# EAGLE design FuckIO_REV01 (EAGLE 9.6.1)
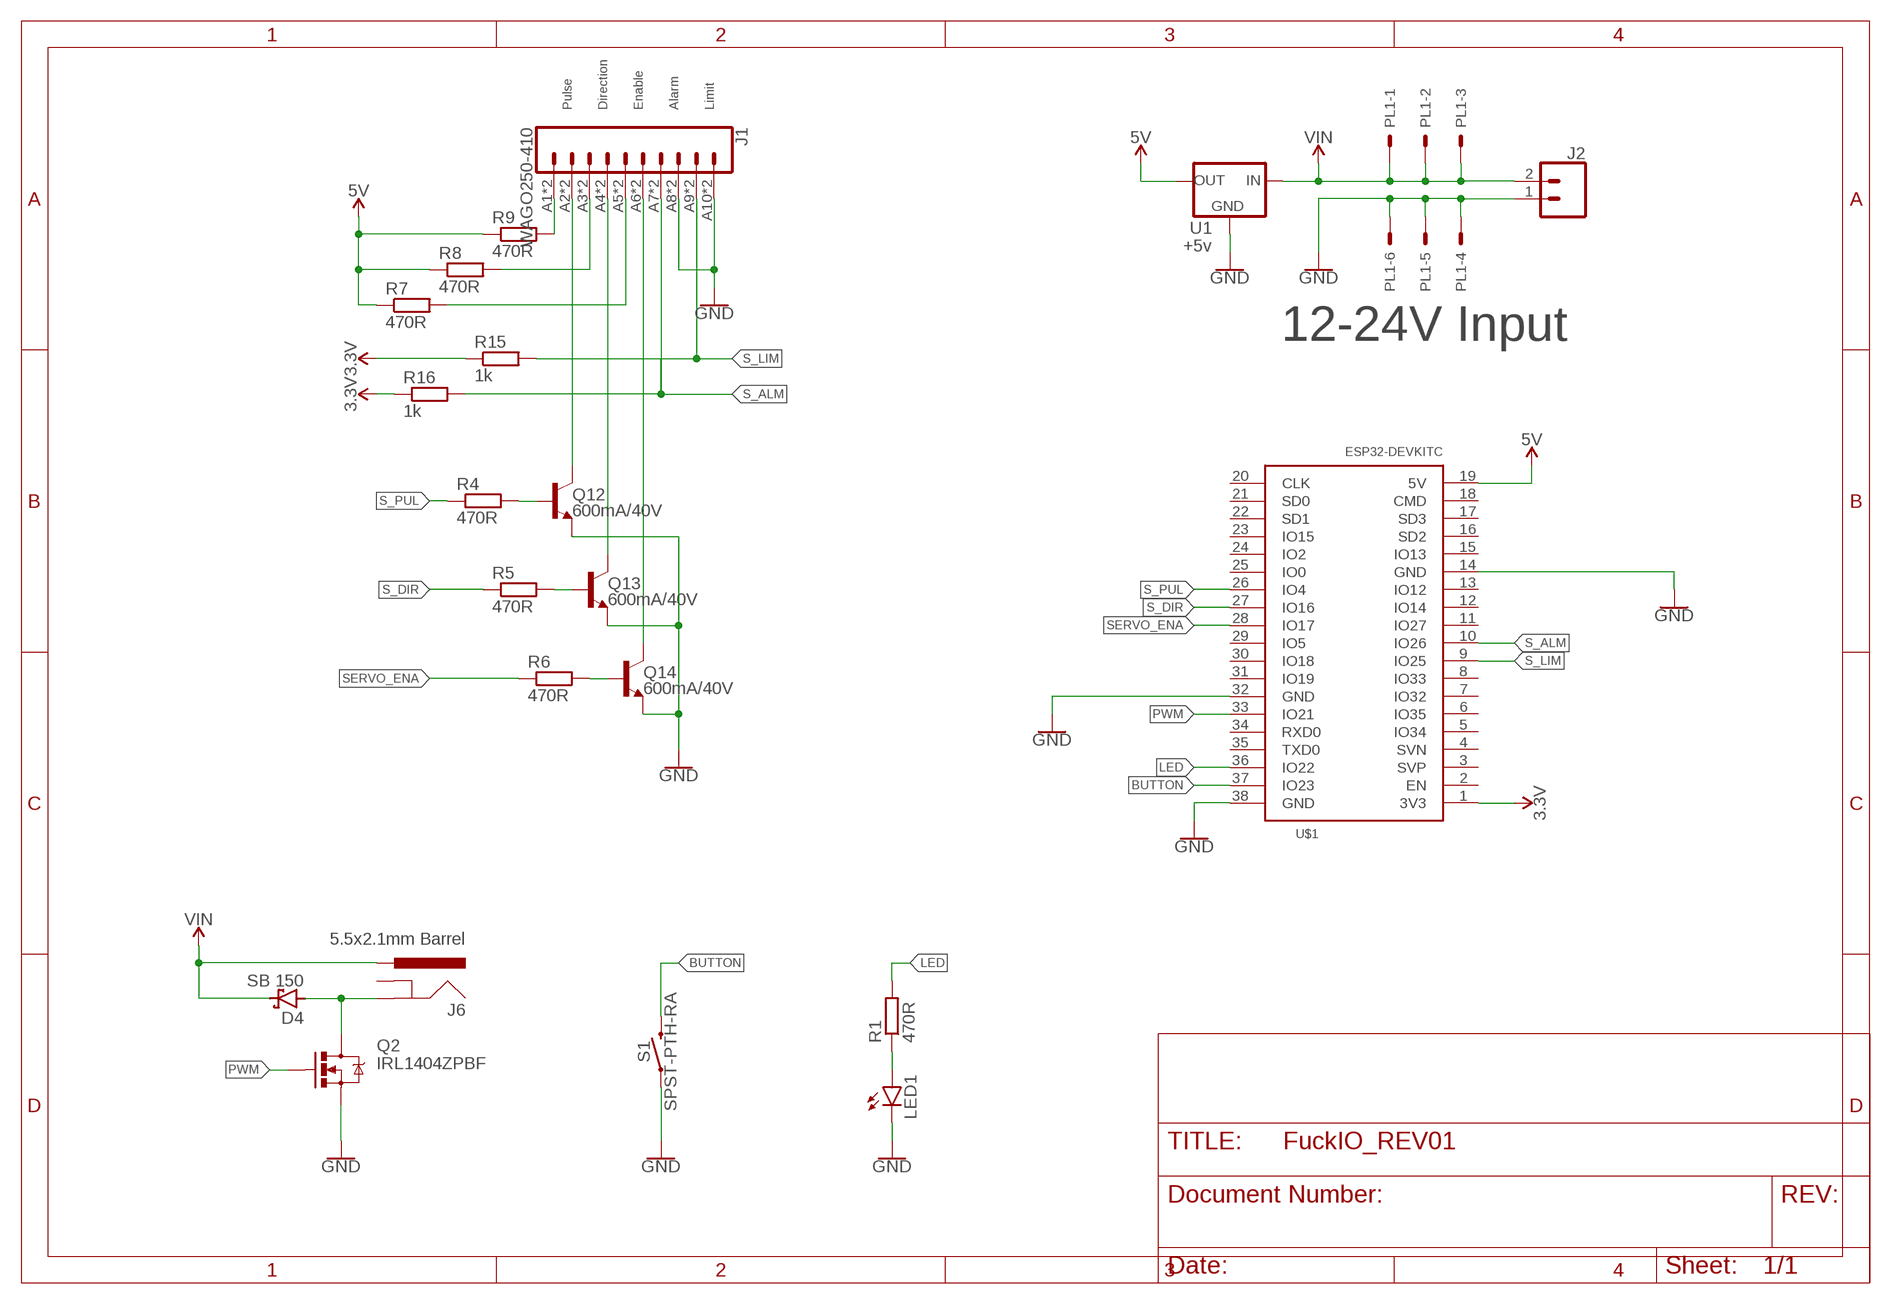
[diagram p0: schematic, sheet 1]

## Parts
D4  SB 150  BAT49  [DIODE_DO41-10]
J1  WAGO250-410  [BEE_WAGO250-410]
J2  CONN_025MM  [SPARKFUN-CONNECTORS_SCREWTERMINAL-5MM-2]
J6  5.5x2.1mm Barrel  POWER_JACK  [SPARKFUN-CONNECTORS_POWER_JACK_PTH]
LED1  LED5MM  [LED5MM]
PL1  CON-MOLEX-2_555X-6H  [CON-MOLEX-2_5569-6]
Q2  IRL1404ZPBF  MOSFET-NCHANNELTO220  [BEE_TO220-IGO]
Q12  600mA/40V  TRANS_NPN-P2N2222A  [SPARKFUN-DISCRETESEMI_TO-92]
Q13  600mA/40V  TRANS_NPN-P2N2222A  [SPARKFUN-DISCRETESEMI_TO-92]
Q14  600mA/40V  TRANS_NPN-P2N2222A  [SPARKFUN-DISCRETESEMI_TO-92]
R1  470R  RCL_R-EU_0204/5  [RCL_0204/5]
R4  470R  RCL_R-EU_0204/5  [RCL_0204/5]
R5  470R  RCL_R-EU_0204/5  [RCL_0204/5]
R6  470R  RCL_R-EU_0204/5  [RCL_0204/5]
R7  470R  RCL_R-EU_0204/5  [RCL_0204/5]
R8  470R  RCL_R-EU_0204/5  [RCL_0204/5]
R9  470R  RCL_R-EU_0204/5  [RCL_0204/5]
R15  1k  RCL_R-EU_0204/5  [RCL_0204/5]
R16  1k  RCL_R-EU_0204/5  [RCL_0204/5]
S1  SPST-PTH-RA  MOMENTARY-SWITCH-SPST-PTH-RIGHT-ANGLE-KIT  [TACTILE_SWITCH_PTH_RIGHT_ANGLE_KIT]
U1  +5v  V_REG_78XXSINK  [SPARKFUN-IC-POWER_TO220-IGO]
U$1  ESP32DEVKITC  [ESP32-DEVKITC]

## Nets
3.3V: R15.1 R16.1 U$1.1(3V3)
5V: R7.1 R8.1 R9.1 U1.OUT U$1.19(5V)
BUTTON: S1.2 U$1.37(IO23)
GND: J1.A8 J1.A10 J1.B8 J1.B10 J2.1 LED1.K(C) PL1.4 PL1.5 PL1.6 Q2.S Q12.3(E) Q13.3(E) Q14.3(E) S1.1 U1.GND U$1.14(GND) U$1.32(GND) U$1.38(GND)
LED: R1.2 U$1.36(IO22)
N$1: LED1.A R1.1
N$2: J1.A5 J1.B5 R7.2
N$9: J1.A3 J1.B3 R8.2
N$10: J1.A1 J1.B1 R9.2
N$11: J1.A6 J1.B6 Q14.1(C)
N$12: J1.A4 J1.B4 Q13.1(C)
N$13: J1.A2 J1.B2 Q12.1(C)
N$18: Q12.2(B) R4.2
N$19: Q13.2(B) R5.2
N$20: Q14.2(B) R6.2
N$30: D4.A J6.GND Q2.D
PWM: Q2.G U$1.33(IO21)
S_ALM: J1.A7 J1.B7 R16.2 U$1.10(IO26)
S_DIR: R5.1 U$1.27(IO16)
S_LIM: J1.A9 J1.B9 R15.2 U$1.9(IO25)
S_PUL: R4.1 U$1.26(IO4)
SERVO_ENA: R6.1 U$1.28(IO17)
VIN: D4.C J2.2 J6.PWR PL1.1 PL1.2 PL1.3 U1.IN
Unconnected: J6.GNDBREAK U$1.2(EN) U$1.3(SVP) U$1.4(SVN) U$1.5(IO34) U$1.6(IO35) U$1.7(IO32) U$1.8(IO33) U$1.11(IO27) U$1.12(IO14) U$1.13(IO12) U$1.15(IO13) U$1.16(SD2) U$1.17(SD3) U$1.18(CMD) U$1.20(CLK) U$1.21(SD0) U$1.22(SD1) U$1.23(IO15) U$1.24(IO2) U$1.25(IO0) U$1.29(IO5) U$1.30(IO18) U$1.31(IO19) U$1.34(RXD0) U$1.35(TXD0)

## Notes on the sheet
- Pulse | Direction | Enable | Alarm | Limit
- 12-24V Input

## Library data of the parts
D4 = FuckIO_REV00:BAT49: DIODE small signal diode
J1 = FuckIO_REV00:WAGO250-410
J2 = FuckIO_REV00:CONN_02: Multi connection point. Often used as Generic Header-pin footprint for 0.1 inch spaced/style header connections On any of the 0.1 inch spaced packages, you can populate with these: Break Away Headers - Straight <https://www.sparkfun.com/products/116> (PRT-00116) Break Away Male Headers - Right Angle <https://www.sparkfun.com/products/553> (PRT-00553) Female Headers <https://www.sparkfun.com/products/115> (PRT-00115) Break Away Headers - Machine Pin <https://www.sparkfun.com/products/117> (PRT-00117) Break Away Female Headers - Swiss Machine Pin <https://www.sparkfun.com/products/743> (PRT-00743) For SCREWTERMINALS and SPRING TERMINALS visit here: Screw Terimnals on SparkFun.com <https://www.sparkfun.com/search/results?term=Screw+Terminals> (5mm/3.5mm/2.54mm spacing) This device is also useful as a general connection point to wire up your design to another part of your project. Our various solder wires solder well into these plated through hole pads. Hook-Up Wire - Assortment (Stranded, 22 AWG) <https://www.sparkfun.com/products/11375> (PRT-11375) Hook-Up Wire - Assortment (Solid Core, 22 AWG) <https://www.sparkfun.com/products/11367> (PRT-11367) View the entire wire category on our website here <https://www.sparkfun.com/categories/141> Special notes: Molex polarized connector foot print use with: PRT-08233 with associated crimp pins and housings. 2.54_SCREWTERM for use with PRT-10571. 3.5mm Screw Terminal footprints for PRT-08084 5mm Screw Terminal footprints for use with PRT-08432; PROD_ID: CONN-13512; SF_ID: PRT-09918; SF_SKU: PRT-08432; SKU: PRT-09914
J6 = FuckIO_REV00:POWER_JACK: Power Jack Connector This is the standard 5.5mm barrel jack for power. The PTH is the most common, proven, reliable, footprint. The Slot footprint only works if the mill layer is transmitted to the PCB fab house so be warned. Here are the connectors we sell at SparkFun: DC Barrel Power Jack/Connector <https://www.sparkfun.com/products/119> (PRT-00119) DC Barrel Power Jack/Connector (SMD) <https://www.sparkfun.com/products/12748> (PRT-12748) DC Barrel Jack Adapter - Breadboard Compatible <https://www.sparkfun.com/products/10811> (PRT-10811) It is used on this SparkFun product (and many, many others): SparkFun RedBoard - Programmed with Arduino <https://www.sparkfun.com/products/12757> (DEV-12757) Also, if you need a mating power supply or connector, please check these out: Wall Adapter Power Supply - 9VDC 650mA <https://www.sparkfun.com/products/298> (TOL-00298) DC Barrel Jack Adapter - Male <https://www.sparkfun.com/products/10287> (PRT-10287); PROD_ID: CONN-08106; SF_ID: PRT-12748
LED1 = led:LED: LED OSRAM: - CHIPLED LG R971, LG N971, LY N971, LG Q971, LY Q971, LO R971, LY R971 LH N974, LH R974 LS Q976, LO Q976, LY Q976 LO Q996 - Hyper CHIPLED LW Q18S LB Q993, LB Q99A, LB R99A - SideLED LS A670, LO A670, LY A670, LG A670, LP A670 LB A673, LV A673, LT A673, LW A673 LH A674 LY A675 LS A676, LA A676, LO A676, LY A676, LW A676 LS A679, LY A679, LG A679 - Hyper Micro SIDELED® LS Y876, LA Y876, LO Y876, LY Y876 LT Y87S - SmartLED LW L88C, LW L88S LB L89C, LB L89S, LG L890 LS L89K, LO L89K, LY L89K LS L896, LA L896, LO L896, LY L896 - TOPLED LS T670, LO T670, LY T670, LG T670, LP T670 LSG T670, LSP T670, LSY T670, LOP T670, LYG T670 LG T671, LOG T671, LSG T671 LB T673, LV T673, LT T673, LW T673 LH T674 LS T676, LA T676, LO T676, LY T676, LB T676, LH T676, LSB T676, LW T676 LB T67C, LV T67C, LT T67C, LS T67K, LO T67K, LY T67K, LW E67C LS E67B, LA E67B, LO E67B, LY E67B, LB E67C, LV E67C, LT E67C LW T67C LS T679, LY T679, LG T679 LS T770, LO T770, LY T770, LG T770, LP T770 LB T773, LV T773, LT T773, LW T773 LH T774 LS E675, LA E675, LY E675, LS T675 LS T776, LA T776, LO T776, LY T776, LB T776 LHGB T686 LT T68C, LB T68C - Hyper Mini TOPLED® LB M676 - Mini TOPLED Santana® LG M470 LS M47K, LO M47K, LY M47K Source: http://www.osram.convergy.de LUXEON: - LUMILED® LXK2-PW12-R00, LXK2-PW12-S00, LXK2-PW14-U00, LXK2-PW14-V00 LXK2-PM12-R00, LXK2-PM12-S00, LXK2-PM14-U00 LXK2-PE12-Q00, LXK2-PE12-R00, LXK2-PE12-S00, LXK2-PE14-T00, LXK2-PE14-U00 LXK2-PB12-K00, LXK2-PB12-L00, LXK2-PB12-M00, LXK2-PB14-N00, LXK2-PB14-P00, LXK2-PB14-Q00 LXK2-PR12-L00, LXK2-PR12-M00, LXK2-PR14-Q00, LXK2-PR14-R00 LXK2-PD12-Q00, LXK2-PD12-R00, LXK2-PD12-S00 LXK2-PH12-R00, LXK2-PH12-S00 LXK2-PL12-P00, LXK2-PL12-Q00, LXK2-PL12-R00 Source: www.luxeon.com KINGBRIGHT: KA-3528ASYC Source: www.kingbright.com
PL1 = FuckIO_REV00:CON-MOLEX-2_555X-6: Mini FIT connector 6 way
Q2 = FuckIO_REV00:MOSFET-NCHANNEL
Q12-Q14 = FuckIO_REV00:TRANS_NPN: NPN transistor Current controlled devices typically used to amplify current or used as a switch. BC547 - COM-08928 <http://www.sparkfun.com/products/8928> (TO-92 45V 100mA) (1.Collector 2.Base 3.Emitter) 2N3904 - COM-00521 <http://www.sparkfun.com/products/521> (TO-92 40V 200mA) (1.Emitter 2.Base 3.Collector) P2N2222A - COM-12852 <http://www.sparkfun.com/products/12852> (TO-92 40V 600mA) (1.Collector 2.Base 3.Emitter); PROD_ID: TRANS-09536
R1 R4-R9 R15 R16 = FuckIO_REV00:RCL_R-EU_: RESISTOR, European symbol; SPICEPREFIX: R
S1 = SparkFun-Switches:MOMENTARY-SWITCH-SPST: Momentary Switch (Pushbutton) - SPST Normally-open (NO) SPST momentary switches (buttons, pushbuttons). Variants PTH-12MM - 12mm square, through-hole Momentary Pushbutton Switch - 12mm Square <https://www.sparkfun.com/products/9190> (COM-09190) PTH-6.0MM, PTH-6.0MM-KIT - 6.0mm square, through-hole Mini Pushbutton Switch <https://www.sparkfun.com/products/97> (COM-00097) KIT package intended for soldering kit's - only one side of pads' copper is exposed. PTH-RIGHT-ANGLE-KIT - Right-angle, through-hole Right Angle Tactile Button <https://www.sparkfun.com/products/10791> - Used on SparkFun BigTime Watch Kit <https://www.sparkfun.com/products/11734> SMD-12MM - 12mm square, surface-mount Tactile Button - SMD (12mm) <https://www.sparkfun.com/products/12993> (COM-12993) Used on SparkFun PicoBoard <https://www.sparkfun.com/products/11888> SMD-4.5MM - 4.5mm Square Trackball Switch Used on SparkFun Blackberry Trackballer Breakout <https://www.sparkfun.com/products/13169> SMD-4.6MMX2.8MM - 4.60mm x 2.80mm, surface mount Used on SparkFun SAMD21 Mini Breakout <https://www.sparkfun.com/products/13664> SMD-5.2MM, SMD-5.2-REDUNDANT - 5.2mm square, surface-mount Mini Pushbutton Switch - SMD <https://www.sparkfun.com/products/8720> (COM-08720) Used on Arduino Pro Mini <https://www.sparkfun.com/products/11114> REDUNDANT package connects both switch circuits together SMD-6.0X3.5MM - 6.0 x 3.5mm, surface mount Momentary Reset Switch SMD <https://www.sparkfun.com/products/8229> (COM-08229) SMD-6.2MM-TALL - 6.2mm square, surface mount Tactile Button - SMD (6mm) <https://www.sparkfun.com/products/12992> Used on SparkFun Digital Sandbox <https://www.sparkfun.com/products/12651> SMD-RIGHT-ANGLE - Right-angle, surface mount Used on SparkFun Block for Intel® Edison - Arduino <https://www.sparkfun.com/products/13036>; PROD_ID: CONN-10672; SF_SKU: COM-10791
U1 = FuckIO_REV00:V_REG_78XX: Voltage Regulator Standard 78xx regulator. IGO (Input Ground Output). Spark Fun Electronics SKU : COM-00107; PROD_ID: VREG-12370; SF_ID: COM-00107; VALUE: +12v
U$1 = ESP32-DEVKITC:ESP32DEVKITC

## Board
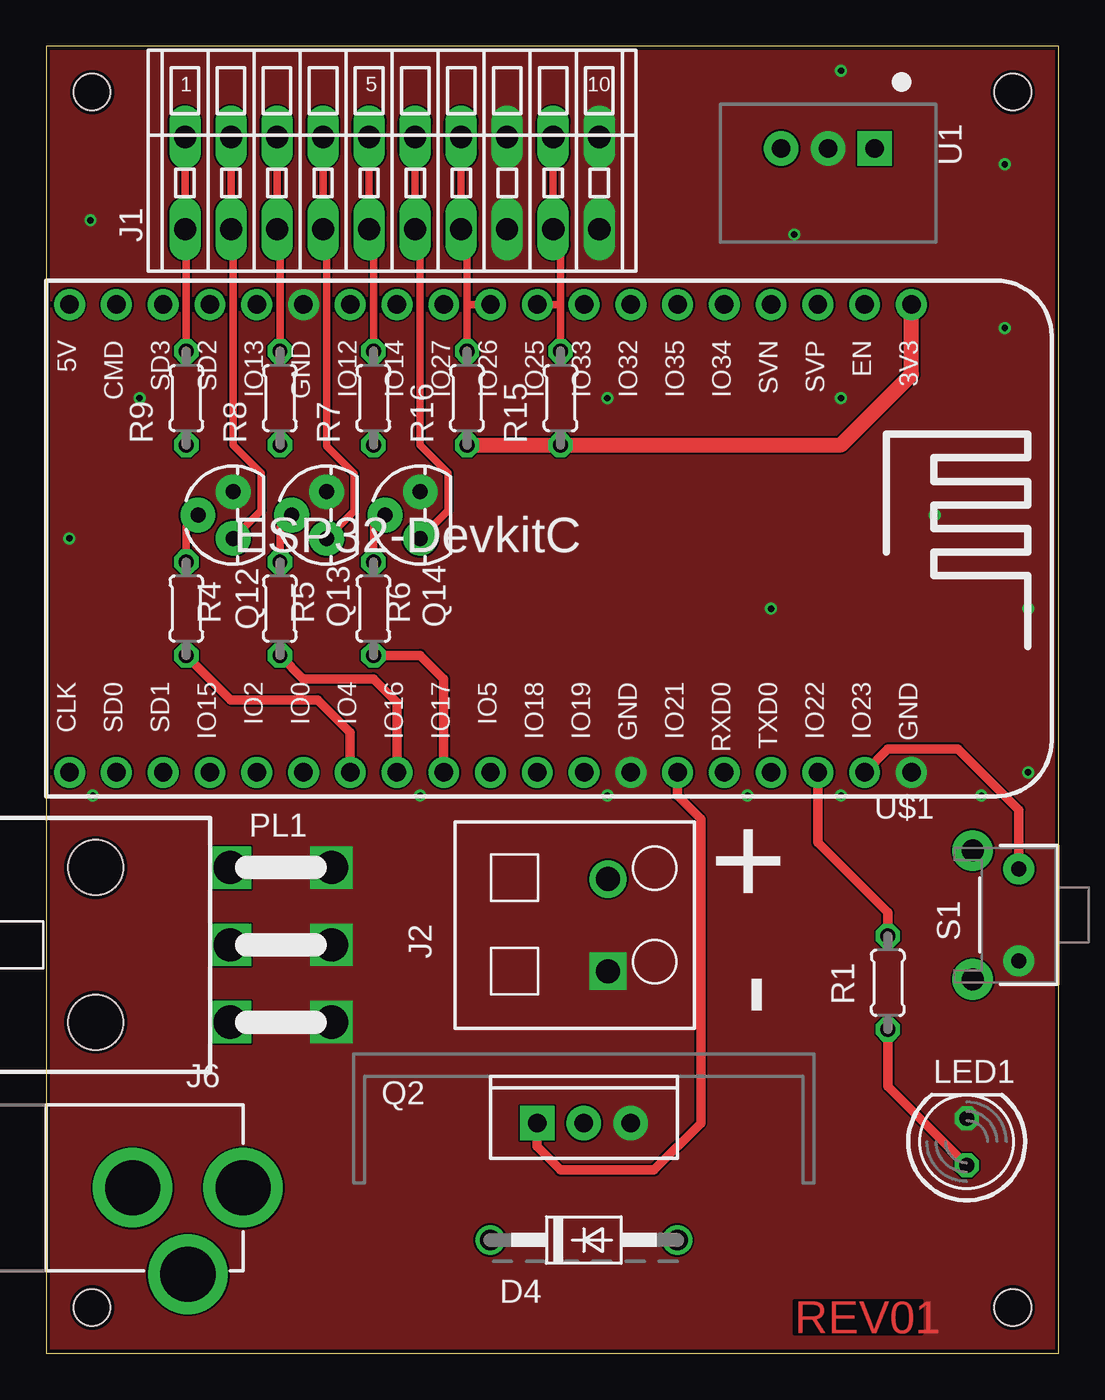
[diagram p1: board, top side]
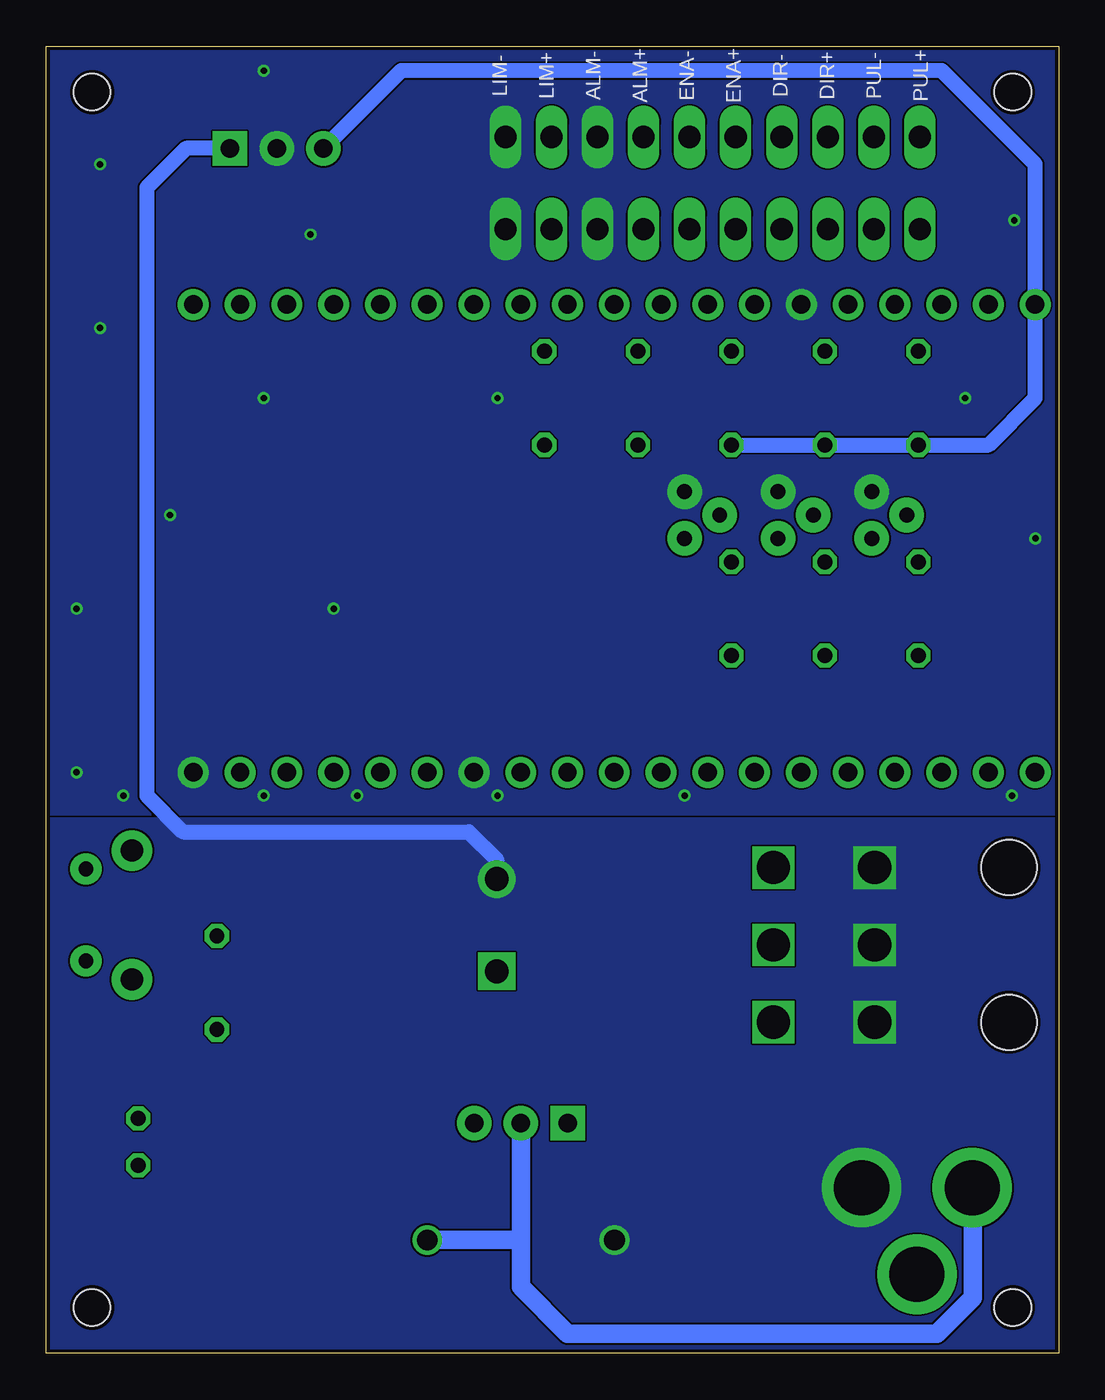
[diagram p2: board, bottom side, seen from below]

Size 55 x 71 mm. Coordinates in mm from the lower left corner, seen from the top.
Outline: 0,0 55,0 55,71 0,71 0,0
Copper layers (1*16): Top 0.035mm / dielectric 0.2mm / Bottom 0.035mm
Design rules "aisler_2_layer_blitz": minimum track width 0.1mm, minimum drill 0.2mm, track to track 0.1mm, track to pad 0.1mm, pad to pad 0.1mm, via to via 0.1mm, smd to smd 0.1mm, copper to edge 0.2mm, drill to drill 0.21mm, minimum pad ring 0.25mm, minimum via ring 0.15mm, stop-mask expansion 0mil, vias tented up to drill 0mil, thermal gap 10mil
Holes 2 mm at 2.5,68.5 52.5,68.5 2.5,2.5 52.5,2.5

### Footprints (pad centres in the part's own frame; a part is rotated, then mirrored left to right if it is on the bottom)
DIODE_DO41-10 = drill 1.118: A 5.08,0; C -5.08,0
BEE_WAGO250-410 = drill 1.2 long: A1 -11.25,2.5; A2 -8.75,2.5; A3 -6.25,2.5; A4 -3.75,2.5; A5 -1.25,2.5; A6 1.25,2.5; A7 3.75,2.5; A8 6.25,2.5; A9 8.75,2.5; A10 11.25,2.5; B1 -11.25,-2.5; B2 -8.75,-2.5; B3 -6.25,-2.5; B4 -3.75,-2.5; B5 -1.25,-2.5; B6 1.25,-2.5; B7 3.75,-2.5; B8 6.25,-2.5; B9 8.75,-2.5; B10 11.25,-2.5
SPARKFUN-CONNECTORS_SCREWTERMINAL-5MM-2 = drill 1.3 pad 2.032 square: 1 -2.54,0 | drill 1.3 pad 2.032: 2 2.46,0
SPARKFUN-CONNECTORS_POWER_JACK_PTH = drill 2.997 pad 4.318: GND 0,7.7; GNDBREAK 4.7,10.7; PWR 0,13.7
LED5MM = drill 0.813 octagon: A -1.27,0; K 1.27,0
CON-MOLEX-2_5569-6 = drill 1.8 square: 1 4.2,0; 2 0,0; 3 -4.2,0; 4 4.2,5.5; 5 0,5.5; 6 -4.2,5.5 | hole 3: 4.2,-7.3; -4.2,-7.3
BEE_TO220-IGO = drill 1 pad 1.88: D 0,0; S 2.54,0 | drill 1 pad 1.88 square: G -2.54,0
SPARKFUN-DISCRETESEMI_TO-92 = drill 0.813 pad 1.88: 1 -1.27,0; 2 0,1.905; 3 1.27,0
RCL_0204/5 = drill 0.813 octagon: 1 -2.54,0; 2 2.54,0
TACTILE_SWITCH_PTH_RIGHT_ANGLE_KIT = drill 0.8 pad 1.7: 1 -2.5,0; 2 2.5,0 | drill 1.2 pad 2.2: ANCHOR1 -3.5,2.5; ANCHOR2 3.5,2.5
SPARKFUN-IC-POWER_TO220-IGO = drill 1 pad 1.88: GND 0,0; OUT 2.54,0 | drill 1 pad 1.88 square: IN -2.54,0
ESP32-DEVKITC = drill 1 pad 1.676: 1 -22.87,-12.7; 2 -20.33,-12.7; 3 -17.79,-12.7; 4 -15.25,-12.7; 5 -12.71,-12.7; 6 -10.17,-12.7; 7 -7.63,-12.7; 8 -5.09,-12.7; 9 -2.55,-12.7; 10 -0.01,-12.7; 11 2.53,-12.7; 12 5.07,-12.7; 13 7.61,-12.7; 14 10.15,-12.7; 15 12.69,-12.7; 16 15.23,-12.7; 17 17.77,-12.7; 18 20.31,-12.7; 19 22.85,-12.7; 20 22.85,12.7; 21 20.31,12.7; 22 17.77,12.7; 23 15.23,12.7; 24 12.69,12.7; 25 10.15,12.7; 26 7.61,12.7; 27 5.07,12.7; 28 2.53,12.7; 29 -0.01,12.7; 30 -2.55,12.7; 31 -5.09,12.7; 32 -7.63,12.7; 33 -10.17,12.7; 34 -12.71,12.7; 35 -15.25,12.7; 36 -17.79,12.7; 37 -20.33,12.7; 38 -22.87,12.7

### Placement (x,y rotation side)
D4  29.21,6.16 0 top
J1  18.8,63.56 0 top
J2  30.52,23.3 90 top
J6  -3,9 270 top
LED1  50,11.49 90 top
PL1  10,22.19 270 top
Q2  29.21,12.51 0 top
Q12  10.16,45.53 90 top
Q13  15.24,45.53 90 top
Q14  20.32,45.53 90 top
R1  45.72,20.13 90 top
R4  7.62,40.45 90 top
R5  12.7,40.45 90 top
R6  17.78,40.45 90 top
R7  17.78,51.88 90 top
R8  12.7,51.88 90 top
R9  7.62,51.88 90 top
R15  27.94,51.88 90 top
R16  22.86,51.88 90 top
S1  52.83,23.81 90 top
U1  42.47,65.44 180 top
U$1  24.13,44.26 180 top

### Tracks (layer width: path | path; a pad name or v marks a point on that pad's centre or on a via)
3.3V
  Top 0.813: R16.1 R15.1 43.18,49.34 47,53.16 U$1.1
5V
  Bottom 0.813: R7.1 R8.1 R9.1 3.81,49.34 1.28,51.87 U$1.19 1.28,64.59 6.35,69.66 35.71,69.66 U1.OUT
BUTTON
  Top 0.508: S1.2 52.83,29.53 49.53,32.83 45.73,32.83 U$1.37
GND  (via drill 0.35)
  other vias: 20.32,30.29 53.34,40.45 39.37,40.45 1.27,44.26 5.08,51.88 52.07,55.69 40.64,60.77 52.07,64.58 30.48,51.88 2.41,61.53 50.8,30.29 43.18,69.66 43.18,51.88 53.34,31.56 43.18,30.29 38.1,30.29 30.48,30.29 48.26,45.53 2.54,30.29
  pour Top (rank 6, no thermals): 0,-0.19 0,70.93 57.15,70.93 57.15,-0.19
  pour Bottom (rank 6, no thermals): 0,29.02 57.15,29.02 57.15,70.93 0,70.93
LED
  Top 0.508: R1.2 45.72,23.94 41.91,27.75 U$1.36
N$1
  Top 0.508: R1.1 45.72,14.5 LED1.A
N$2
  Top 0.406: J1.A5 J1.B5 17.78,60.83 R7.2
N$9
  Top 0.406: J1.A3 J1.B3 12.7,60.91 R8.2
N$10
  Top 0.406: J1.A1 J1.B1 7.62,60.99 R9.2
N$11
  Top 0.406: J1.A6 J1.B6 20.32,60.79 20.32,49.34 21.84,47.82 21.84,45.78 Q14.1
N$12
  Top 0.406: J1.A4 J1.B4 15.24,60.87 15.24,49.29 16.74,47.79 16.74,45.76 Q13.1
N$13
  Top 0.406: J1.A2 J1.B2 10.16,60.95 10.16,49.34 11.68,47.82 11.68,45.78 Q12.1
N$18
  Top 0.406: Q12.2 7.62,44.9 R4.2
N$19
  Top 0.406: Q13.2 12.7,44.9 R5.2
N$20
  Top 0.406: Q14.2 17.78,44.9 R6.2
N$30
  Bottom 1.016: J6.GND 4.68,8.98 4.68,3.03 6.63,1.08 26.67,1.08 29.21,3.62 29.21,6.16 | 29.21,6.16 Q2.D | D4.A 29.21,6.16
PWM
  Top 0.508: Q2.G 26.67,11.24 27.94,9.97 33.02,9.97 35.56,12.51 35.56,29.02 34.29,30.29 U$1.33
S_ALM
  Top 0.406: J1.A7 J1.B7 22.86,60.75 22.86,56.96 | 22.86,56.96 R16.2 | 22.86,56.96 U$1.10
S_DIR
  Top 0.508: R5.1 13.97,36.64 17.78,36.64 19.06,35.36 U$1.27
S_LIM
  Top 0.406: J1.A9 J1.B9 27.94,60.67 27.94,56.96 | 27.94,56.96 R15.2 | U$1.9 27.94,56.96
S_PUL
  Top 0.508: R4.1 10.04,35.49 14.76,35.49 16.52,33.73 U$1.26
SERVO_ENA
  Top 0.508: R6.1 20.32,37.91 21.6,36.63 U$1.28
VIN
  Bottom 0.813: U1.IN 47.4,65.44 49.53,63.31 49.53,30.29 47.57,28.33 32.04,28.33 30.52,26.81 J2.2
  pour Bottom (no thermals): 0,-0.19 55.88,-0.19 55.88,29.02 0,29.02

### Text on the board
Top: REV01
tPlace: - +
bPlace: PUL+ | PUL- | DIR+ | DIR- | ENA+ | ENA- | ALM+ | ALM- | LIM+ | LIM-